# Altium schematic sheet C-09 BOOT_CFG.SchDoc
size 513 x 386 mm; Address1: 350W 9th Ave; Address2: Suite 206; Address3: Escondido CA 92025; Address4: United States; Revision: -; ENG_APP_DATE: --/--/--; DSN_APP_DATE: --/--/--; CHK_APP_DATE: --/--/--
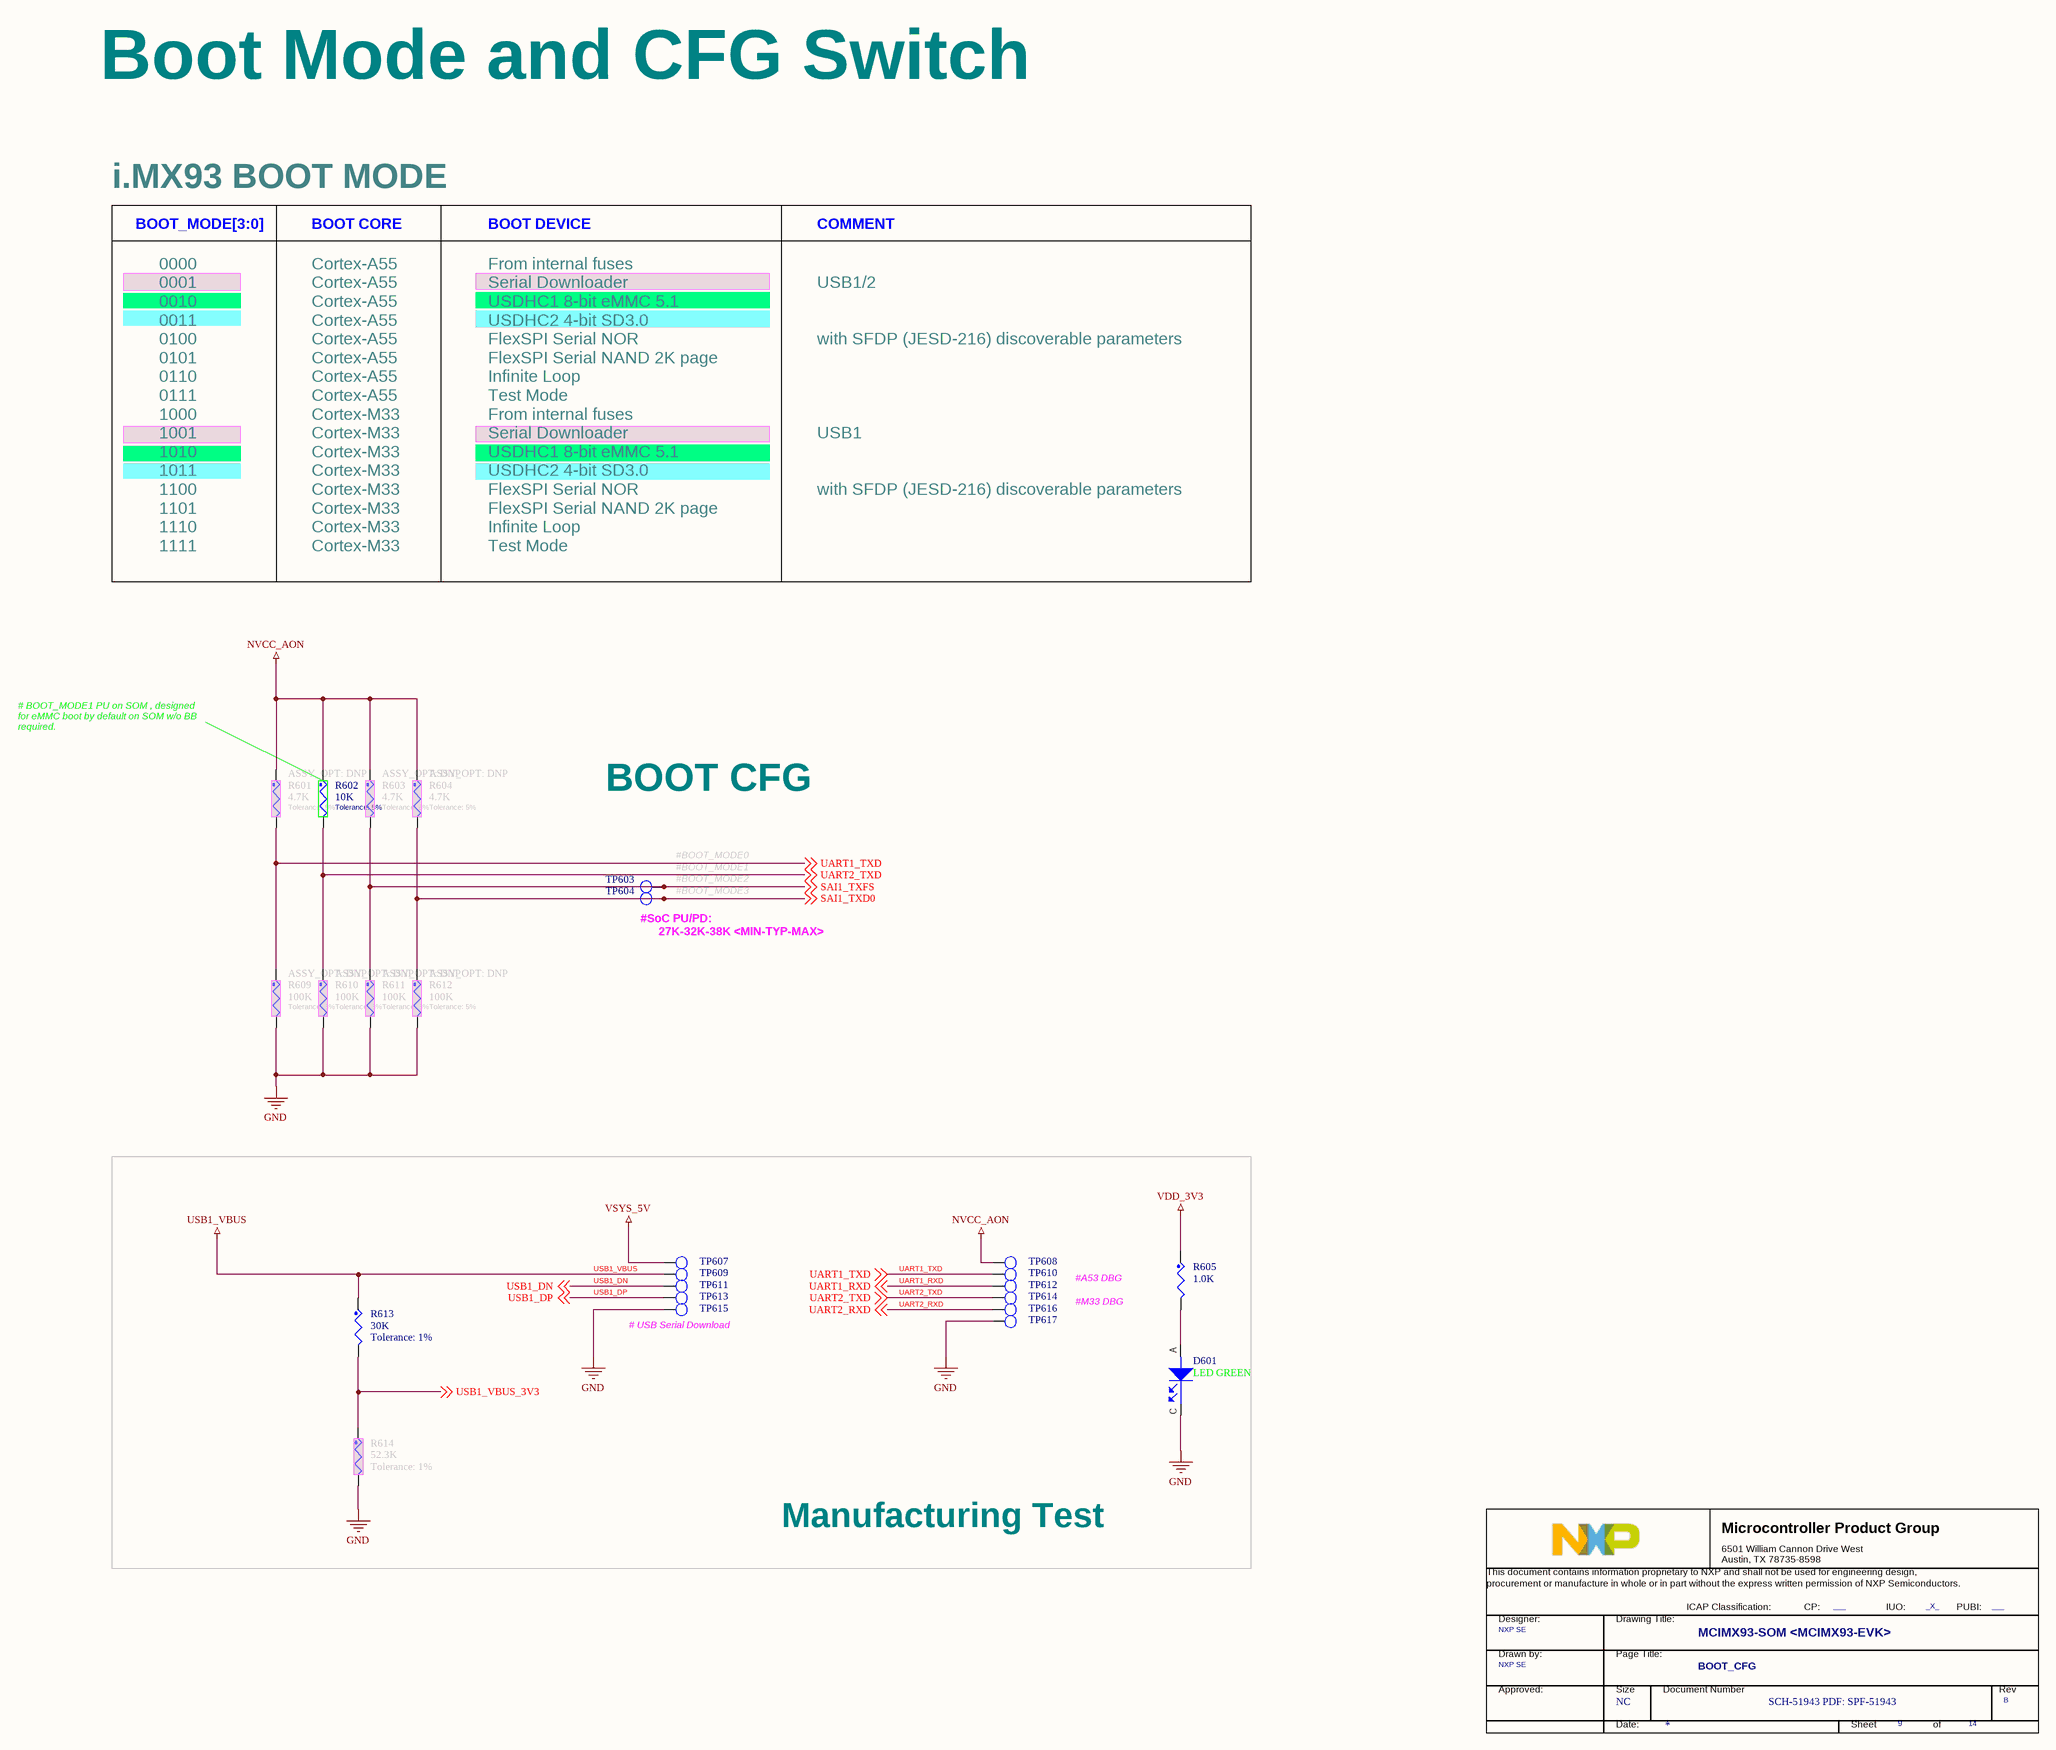
[diagram p0: C-09 BOOT_CFG.SchDoc]

## Parts
*  Doc: SCH-51943 PDF: SPF-51943  RevCode: B  Title: MCIMX93-SOM <MCIMX93-EVK>  Page Size: NC  Page Number: 9  Page Count: 14  PageTitle: BOOT_CFG  Designer: NXP SE  PUBI: ___  FIUO: _X_  (hidden comment: TitleBlock_MCPG)  (graphical)
D601  LED GREEN  [LED_0603]
R601  4.7K  ASSY_OPT: DNP  Tolerance: 5%  [0402_CC]
R602  10K  Tolerance: 5%  [0402_CC]
R603  4.7K  ASSY_OPT: DNP  Tolerance: 5%  [0402_CC]
R604  4.7K  ASSY_OPT: DNP  Tolerance: 5%  [0402_CC]
R605  1.0K  [0402_CC]
R609  100K  ASSY_OPT: DNP  Tolerance: 5%  [0402_CC]
R610  100K  ASSY_OPT: DNP  Tolerance: 5%  [0402_CC]
R611  100K  ASSY_OPT: DNP  Tolerance: 5%  [0402_CC]
R612  100K  ASSY_OPT: DNP  Tolerance: 5%  [0402_CC]
R613  30K  Tolerance: 1%  [0402_CC]
R614  52.3K  Tolerance: 1%  [0201_CC]
TP603  TP_35MIL  [testpoint_35mil]  (value not drawn)  (no BOM)
TP604  TP_35MIL  [testpoint_35mil]  (value not drawn)  (no BOM)
TP607  TP_35MIL  [testpoint_35mil]  (value not drawn)  (no BOM)
TP608  TP_35MIL  [testpoint_35mil]  (value not drawn)  (no BOM)
TP609  TP_35MIL  [testpoint_35mil]  (value not drawn)  (no BOM)
TP610  TP_35MIL  [testpoint_35mil]  (value not drawn)  (no BOM)
TP611  TP_35MIL  [testpoint_35mil]  (value not drawn)  (no BOM)
TP612  TP_35MIL  [testpoint_35mil]  (value not drawn)  (no BOM)
TP613  TP_35MIL  [testpoint_35mil]  (value not drawn)  (no BOM)
TP614  TP_35MIL  [testpoint_35mil]  (value not drawn)  (no BOM)
TP615  TP_35MIL  [testpoint_35mil]  (value not drawn)  (no BOM)
TP616  TP_35MIL  [testpoint_35mil]  (value not drawn)  (no BOM)
TP617  TP_35MIL  [testpoint_35mil]  (value not drawn)  (no BOM)

## Blocks framed on the sheet
Manufacturing Test: D601 R605 R613 R614 TP607-TP617

## Nets
GND: D601.C(CATHODE) R609.2 R610.2 R611.2 R612.2 R614.2 TP615.1(TP) TP617.1(TP)
NVCC_AON: R601.1 R602.1 R603.1 R604.1 TP608.1(TP)
USB1_VBUS: R613.1 TP609.1(TP)
VDD_3V3: R605.1
VSYS_5V: TP607.1(TP)
SAI1_TXD0: R604.2 R612.1 TP604.1(TP) ; off-sheet SAI1_TXD0
SAI1_TXFS: R603.2 R611.1 TP603.1(TP) ; off-sheet SAI1_TXFS
UART1_RXD: TP612.1(TP) ; off-sheet UART1_RXD
UART1_TXD: R601.2 R609.1 TP610.1(TP) ; off-sheet UART1_TXD
UART2_RXD: TP616.1(TP) ; off-sheet UART2_RXD
UART2_TXD: R602.2 R610.1 TP614.1(TP) ; off-sheet UART2_TXD
USB1_DN: TP611.1(TP) ; off-sheet USB1_DN
USB1_DP: TP613.1(TP) ; off-sheet USB1_DP
USB1_VBUS_3V3: R613.2 R614.1 ; off-sheet USB1_VBUS_3V3
NetD601_A: D601.A(ANODE) R605.2

## Notes on the sheet
- Boot Mode and CFG Switch
- i.MX93 BOOT MODE
- BOOT_MODE[3:0]
- BOOT CORE
- BOOT DEVICE
- COMMENT
- 0000
  0001
  0010
  0011
  0100
  0101
  0110
  0111
  1000
  1001
  1010
  1011
  1100
  1101
  1110
  1111
- Cortex-A55
  Cortex-A55
  Cortex-A55
  Cortex-A55
  Cortex-A55
  Cortex-A55
  Cortex-A55
  Cortex-A55
  Cortex-M33
  Cortex-M33
  Cortex-M33
  Cortex-M33
  Cortex-M33
  Cortex-M33
  Cortex-M33
  Cortex-M33
- From internal fuses
  Serial Downloader
  USDHC1 8-bit eMMC 5.1
  USDHC2 4-bit SD3.0
  FlexSPI Serial NOR
  FlexSPI Serial NAND 2K page
  Infinite Loop
  Test Mode
  From internal fuses
  Serial Downloader
  USDHC1 8-bit eMMC 5.1
  USDHC2 4-bit SD3.0
  FlexSPI Serial NOR
  FlexSPI Serial NAND 2K page
  Infinite Loop
  Test Mode
- USB1/2
  with SFDP (JESD-216) discoverable parameters
  USB1
  with SFDP (JESD-216) discoverable parameters
- # BOOT_MODE1 PU on SOM , designed
  for eMMC boot by default on SOM w/o BB
  required.
- BOOT CFG
- #BOOT_MODE0
- #BOOT_MODE1
- #BOOT_MODE2
- #BOOT_MODE3
- (near TP604) #SoC PU/PD:
  27K-32K-38K <MIN-TYP-MAX>
- #A53 DBG
- (near TP615) # USB Serial Download
- #M33 DBG
- 8
- 7
- 6
- 5
- 4
- 3
- 2
- 1
- REVISION
- DESCRIPTION
- DATE
- APPROVED
- F
- E
- D
- C
- B
- PROJECT:
- REV.
- ENG:
- APPROVALS
- PROJECT
- JordanDSP LLC <https://www.jordandsp.com>
- Envision Excellence
- SHT.
- A
- DSN:
- CHK:
- REFERENCE ITEMS
- PRJ VCS REVISION:
- TITLE
- DOC VCS REVISION:
- MODIFIED DATE:
- BOM:
- FAB DWG:
- FIRMWARE:
- ASSY DWG:
- SCALE:
- SIZE
- CAGE CODE
- FILE NAME
- DWG NO.
- PAGE
- PRODUCT REV
- OF
- (in symbol TitleBlock_MCPG) Microcontroller Product Group; 6501 William Cannon Drive West / Austin, TX 78735-8598; This document contains information proprietary to NXP and shall not be used for engineering design,; procurement or manufacture in whole or in part without the express written permission of NXP Semiconductors.; ICAP Classification:; CP:; IUO:; PUBI:; Designer:; Drawing Title:; Drawn by:; Page Title:; Approved:; Size; Document Number; Rev; Date:; Sheet; of

## Library data of the parts
* = TitleBlock_MCPG: OrgAddr1: NO. 192 Liangjing Rd. Pudong New Area, ShangHai; OrgName: NXP Semiconductor; Page Create Date: March  8, 1995; DrawnBy: NXP SE; FCP: ___; Page Modify Date: *
D601 = LED: LED GRN SGL 25MA SMT 0603; CLASS: IC; CAD_APPROVED: Yes; MFG_PN01: 598-8070-107F; MFG_NAME01: DIALIGHT; AGILE_PN: 370-76672; VOLTAGE: 2V; HEIGHT: 0.8 MM; ROHS: Yes; PCB Footprint: LED_0603
R601 = RES: RES MF 4.7K 1/10W 5% AEC-Q200 0402; CLASS: DISCRETE; MFG_PN01: RK73B1ETTP472J; MFG_NAME01: KOA SPEER; CAD_APPROVED: Yes; FPLIST: RC0402_25,RC0402_HD,0402_CC,RC0402_X2; AGILE_PN: 470-82064; VOLTAGE: 50V; Temp Range: -55C to +155C; PCB Footprint: 0402_CC; ROHS: Yes; HEIGHT: 0.41mm
R602 = RES: RES MF 10K 1/16W 5% 0402; CLASS: DISCRETE; AGILE_PN: 470-75557; MFG_NAME01: VISHAY INTERTECHNOLOGY; MFG_PN01: CRCW040210K0JNED; CAD_APPROVED: Yes; FPLIST: RC0402_25,RC0402_HD,0402_CC; PCB Footprint: 0402_CC; ROHS: Yes; HEIGHT: 0.4 MM
R603 R604 = RES: RES MF 4.7K 1/10W 5% AEC-Q200 0402; CLASS: DISCRETE; Temp Range: -55C to +155C; VOLTAGE: 50V; AGILE_PN: 470-82064; FPLIST: RC0402_25,RC0402_HD,0402_CC,RC0402_X2; CAD_APPROVED: Yes; MFG_NAME01: KOA SPEER; MFG_PN01: RK73B1ETTP472J; PCB Footprint: 0402_CC; HEIGHT: 0.41mm; ROHS: Yes
R605 = RES: RES MF 1.0K 1/16W 1% 0402; CLASS: DISCRETE; MFG_PN01: RC0402FR-071KL; MFG_NAME01: YAGEO AMERICA; CAD_APPROVED: Yes; FPLIST: RC0402_25,RC0402_HD,RC0402_X2,0402_CC; AGILE_PN: 470-76037; PCB Footprint: 0402_CC; VOLTAGE: 1/16W; ROHS: Yes; Tolerance: 1%; HEIGHT: 0.4MM
R609 R612 = RES: RES MF 100K 1/16W 5% 0402; CLASS: DISCRETE; MFG_PN01: CR0402-16W-104JT; MFG_NAME01: VENKEL COMPANY; Temp Range: -55C to +155C; CAD_APPROVED: Yes; FPLIST: RC0402_25,RC0402_HD,0402_CC; AGILE_PN: 470-75597; VOLTAGE: 50V; PCB Footprint: 0402_CC; ROHS: Yes; HEIGHT: 0.40 MM
R610 R611 = RES: RES MF 100K 1/16W 5% 0402; CLASS: DISCRETE; AGILE_PN: 470-75597; FPLIST: RC0402_25,RC0402_HD,0402_CC; CAD_APPROVED: Yes; Temp Range: -55C to +155C; MFG_NAME01: VENKEL COMPANY; MFG_PN01: CR0402-16W-104JT; VOLTAGE: 50V; PCB Footprint: 0402_CC; HEIGHT: 0.40 MM; ROHS: Yes
R613 = RES: RES MF 30K 1/10W 1% AEC-Q200 0402; CLASS: DISCRETE; MFG_PN01: RK73H1ETTP3002F; MFG_NAME01: KOA SPEER; Temp Range: -55C to +155C; VOLTAGE: 50V; CAD_APPROVED: Yes; FPLIST: RC0402_25,RC0402_HD,0402_CC; AGILE_PN: 470-81708; PCB Footprint: 0402_CC; ROHS: Yes; HEIGHT: 0.40 MM
R614 = RES: RES MF 52.3K OHM 1% 1/20W 0201; CLASS: DISCRETE; MFG_PN01: RC0201FR-0752K3L; MFG_NAME01: YAGEO AMERICA; Temp Range: -55&#8451; to 125&#8451;; CAD_APPROVED: Yes; FPLIST: RC0201,0201_CC; AGILE_PN: 470-81464; ROHS: Yes; HEIGHT: 0.26MM; PCB Footprint: 0201_CC
TP603 TP607 TP614 TP616 TP617 = T POINT R: TEST POINT PAD .035 SMT, no part to order; ASSY_OPT: DNP; CLASS: IC; CAD_APPROVED: Yes; AGILE_PN: 510-75618; PCB Footprint: testpoint_35mil; HEIGHT: 0.1MM; ROHS: Yes
TP604 TP608-TP613 TP615 = T POINT R: TEST POINT PAD .035 SMT, no part to order; ASSY_OPT: DNP; CLASS: IC; AGILE_PN: 510-75618; CAD_APPROVED: Yes; PCB Footprint: testpoint_35mil; ROHS: Yes; HEIGHT: 0.1MM